# Altium schematic sheet NFC_Access_MainPage_R00.SchDoc: NFC Access Board
size A4; Author: Hernan M. Travado; CompanyName: UTN FRBA; DocumentNumber: 1.0; SheetNumber: 1; SheetTotal: 7
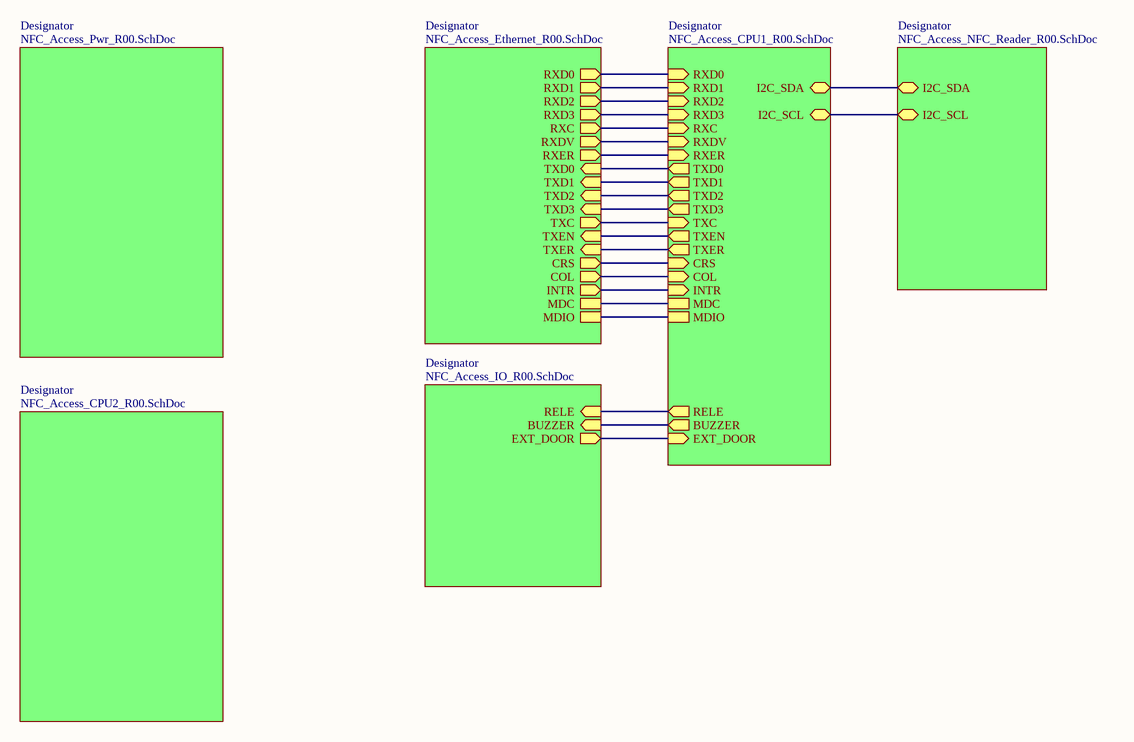
[diagram p0: NFC_Access_MainPage_R00.SchDoc]

## Sub-sheets
Designator = NFC_Access_CPU1_R00.SchDoc: CRS (in), COL (in), RXC (in), MDIO, RXDV (in), RXD2 (in), RXD3 (in), RXER (in), TXEN (out), TXD0 (out), TXD1 (out), RXD0 (in), MDC, TXC (in), TXD2 (out), RXD1 (in), TXD3 (out), INTR (in), TXER (out), RELE (out), EXT_DOOR (in), BUZZER (out), I2C_SCL (bidir), I2C_SDA (bidir)
Designator = NFC_Access_Ethernet_R00.SchDoc: RXD1 (out), RXD2 (out), RXD3 (out), RXD0 (out), RXC (out), RXDV (out), RXER (out), TXD1 (in), TXD2 (in), TXD3 (in), TXD0 (in), COL (out), CRS (out), TXC (out), TXEN (in), TXER (in), INTR (out), MDC, MDIO
Designator = NFC_Access_NFC_Reader_R00.SchDoc: I2C_SDA (bidir), I2C_SCL (bidir)
Designator = NFC_Access_IO_R00.SchDoc: RELE (in), BUZZER (in), EXT_DOOR (out)
Designator = NFC_Access_Pwr_R00.SchDoc: no entries
Designator = NFC_Access_CPU2_R00.SchDoc: no entries

## Nets
(unnamed): sheet Designator/CRS, sheet Designator/CRS
(unnamed): sheet Designator/COL, sheet Designator/COL
(unnamed): sheet Designator/RXC, sheet Designator/RXC
(unnamed): sheet Designator/MDIO, sheet Designator/MDIO
(unnamed): sheet Designator/RXDV, sheet Designator/RXDV
(unnamed): sheet Designator/RXD2, sheet Designator/RXD2
(unnamed): sheet Designator/RXD3, sheet Designator/RXD3
(unnamed): sheet Designator/RXER, sheet Designator/RXER
(unnamed): sheet Designator/TXEN, sheet Designator/TXEN
(unnamed): sheet Designator/TXD0, sheet Designator/TXD0
(unnamed): sheet Designator/TXD1, sheet Designator/TXD1
(unnamed): sheet Designator/RXD0, sheet Designator/RXD0
(unnamed): sheet Designator/MDC, sheet Designator/MDC
(unnamed): sheet Designator/TXC, sheet Designator/TXC
(unnamed): sheet Designator/TXD2, sheet Designator/TXD2
(unnamed): sheet Designator/RXD1, sheet Designator/RXD1
(unnamed): sheet Designator/TXD3, sheet Designator/TXD3
(unnamed): sheet Designator/INTR, sheet Designator/INTR
(unnamed): sheet Designator/TXER, sheet Designator/TXER
(unnamed): sheet Designator/RELE, sheet Designator/RELE
(unnamed): sheet Designator/EXT_DOOR, sheet Designator/EXT_DOOR
(unnamed): sheet Designator/BUZZER, sheet Designator/BUZZER
(unnamed): sheet Designator/I2C_SCL, sheet Designator/I2C_SCL
(unnamed): sheet Designator/I2C_SDA, sheet Designator/I2C_SDA

## Notes on the sheet
- Title:
- Size:
- Author:
- A4
- Sheet
- of
- Revision:
- File:
- Date: